# Altium schematic sheet CAN.SchDoc
size A4
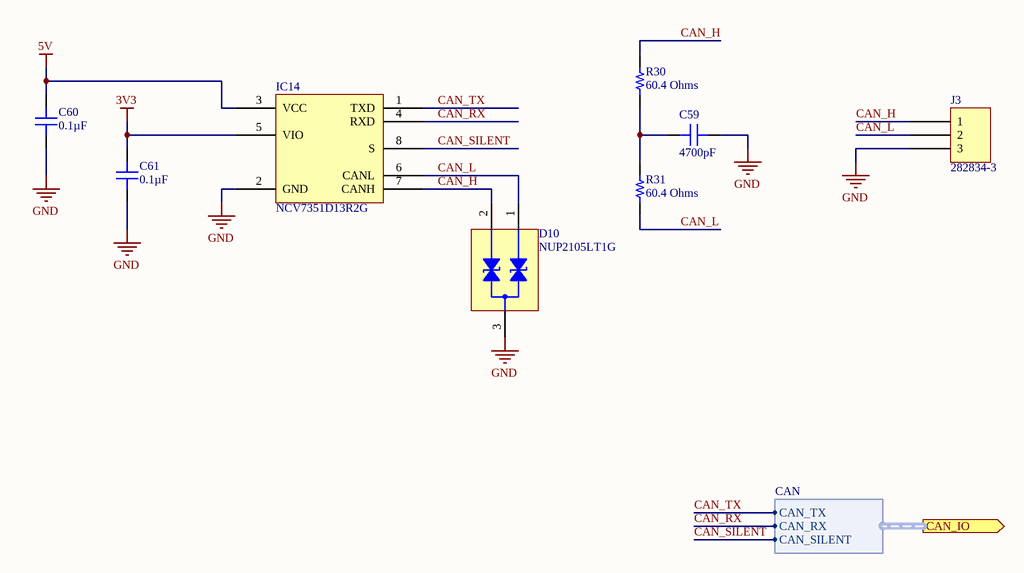
[diagram p0: CAN.SchDoc]

## Parts
C59  4700pF  [CAP 0201_0603]
C60  0.1µF  [CAP 0201_0603]
C61  0.1µF  [CAP 0201_0603]
D10  NUP2105LT1G  [ON SEMI SOT-23-3]
IC14  NCV7351D13R2G  [ON SEMI - SOIC-8 751AZ]
J3  282834-3  [TE 282834-3]
R30  60.4 Ohms  [RES 0201_0603]
R31  60.4 Ohms  [RES 0201_0603]

## Ports
CAN_IO (out, harness CAN)

## Harnesses
CAN: CAN_TX, CAN_RX, CAN_SILENT

## Nets
3V3: C61.2 IC14.5(VIO)
5V: C60.2 IC14.3(VCC)
GND: C59.2 C60.1 C61.1 D10.3(I/O_2) IC14.2(GND) J3.3
CAN_H: D10.2(GND) IC14.7(CANH) J3.1 R30.1
CAN_L: D10.1(I/O_1) IC14.6(CANL) J3.2 R31.2
CAN_RX: IC14.4(RXD) ; port CAN_IO.CAN_RX
CAN_SILENT: IC14.8(S) ; port CAN_IO.CAN_SILENT
CAN_TX: IC14.1(TXD) ; port CAN_IO.CAN_TX
NetC59_1: C59.1 R30.2 R31.1

## Notes on the sheet
- Title
- Size:
- Date:
- A4
- Number:
- Time:
- Revision:
- Sheet
- of
- File:

## Library data of the parts
C59 = GRM033R71E472KE14D: CAP CER 4700PF 25V X7R 0201; Manufacturer: Murata Electronics; Tolerance: ±10%; Part Number: GRM033R71E472KE14D; Value: 4700pF; Applications: General Purpose; Capacitance: 4700pF; ComponentLink1Description: Datasheet; ComponentLink1URL: https://search.murata.co.jp/Ceramy/image/img/A01X/G101/ENG/GRM033R71E472KE14-01.pdf; ComponentLink2Description: DigiKey Link; ComponentLink2URL: http://digikey.com/product-detail/en/murata-electronics/GRM033R71E472KE14D/490-14455-1-ND/6606916; Device Package: 0201 (0603 Metric); LastUpdated: 21/01/2020 00:00:16; Lifecycle Status: Active; Minimum Order: 1; Mounting Type: Surface Mount, MLCC; Operating Temperature: -55°C ~ 125°C; Package / Case: 0201 (0603 Metric); Packaging: CutTape; PartId: 986; Part Status: Active; Price: 0.10; Series: GRM; Size / Dimension: 0.024" L x 0.012" W (0.60mm x 0.30mm); Supplier 1: DigiKey; Supplier Part Number 1: 490-14455-1-ND; Temperature Coefficient: X7R; Thickness (Max): 0.013" (0.33mm); Voltage - Rated: 25V
C60 C61 = GRM033R61C104ME84D: CAP CER 0.1UF 16V X5R 0201; Manufacturer: Murata Electronics; Tolerance: ±20%; Part Number: GRM033R61C104ME84D; Value: 0.1µF; Applications: General Purpose; Capacitance: 0.1µF; ComponentLink1Description: Datasheet; ComponentLink1URL: https://search.murata.co.jp/Ceramy/image/img/A01X/G101/ENG/GRM033R61C104ME84-01.pdf; ComponentLink2Description: DigiKey Link; ComponentLink2URL: http://digikey.com/product-detail/en/murata-electronics/GRM033R61C104ME84D/490-9986-1-ND/5026291; Device Package: 0201 (0603 Metric); LastUpdated: 21/01/2020 00:00:12; Lifecycle Status: Active; Minimum Order: 1; Mounting Type: Surface Mount, MLCC; Operating Temperature: -55°C ~ 85°C; Package / Case: 0201 (0603 Metric); Packaging: TapeAndReel; PartId: 1522; Part Status: Active; Price: 0.01; Series: GRM; Size / Dimension: 0.024" L x 0.012" W (0.60mm x 0.30mm); Supplier 1: DigiKey; Supplier Part Number 1: 490-9986-1-ND; Temperature Coefficient: X5R; Thickness (Max): 0.013" (0.33mm); Voltage - Rated: 16V
D10 = NUP2105LT1G: TVS DIODE 24V 44V SOT23-3; Manufacturer: ON Semiconductor; Bidirectional Channels: 2; Capacitance @ Frequency: 30pF @ 1MHz; Current - Peak Pulse (10/1000µs): 8A (8/20µs); Power Line Protection: No; Power - Peak Pulse: 350W; Type: Zener; Voltage - Breakdown (Min): 26.2V; Voltage - Reverse Standoff (Typ): 24V (Min); Part Number: NUP2105LT1G; Applications: General Purpose; ComponentLink1Description: Datasheet; ComponentLink1URL: http://www.onsemi.com/pub/Collateral/NUP2105L-D.PDF; ComponentLink2Description: DigiKey Link; ComponentLink2URL: http://digikey.com/product-detail/en/on-semiconductor/NUP2105LT1G/NUP2105LT1GOSCT-ND/1485001; Device Package: TO-236-3, SC-59, SOT-23-3; LastUpdated: 30/03/2020 16:33:57; Lifecycle Status: Active; Minimum Order: 1; Mounting Type: Surface Mount; Operating Temperature: -55°C ~ 150°C (TJ); Package / Case: TO-236-3, SC-59, SOT-23-3; Packaging: TapeAndReel; PartId: 10506; Part Status: Active; Price: 0.09; Series: -; Supplier 1: DigiKey; Supplier Part Number 1: NUP2105LT1GOSCT-ND; Supplier Device Package: SOT-23-3 (TO-236); Voltage - Clamping (Max) @ Ipp: 44V
IC14 = NCV7351D13R2G: IC TRANSCEIVER HALF 1/1 8SOIC; Manufacturer: ON Semiconductor; Protocol: CANbus; Voltage - Supply: 4.5V ~ 5.5V; Part Number: NCV7351D13R2G; ComponentLink1Description: Datasheet; ComponentLink1URL: http://www.onsemi.com/pub/Collateral/NCV7351-D.PDF; ComponentLink2Description: DigiKey Link; ComponentLink2URL: http://digikey.com/product-detail/en/on-semiconductor/NCV7351D13R2G/NCV7351D13R2GOSCT-ND/4707705; Device Package: 8-SOIC (0.154", 3.90mm Width); Duplex: Half; LastUpdated: 30/03/2020 16:32:13; Lifecycle Status: Active; Minimum Order: 1; Mounting Type: Surface Mount; Number of Drivers/Receivers: 1/1; Operating Temperature: -40°C ~ 125°C; Package / Case: 8-SOIC (0.154", 3.90mm Width); Packaging: TapeAndReel; Part Status: Active; Price: 0.36; Series: Automotive, AEC-Q100; Supplier 1: DigiKey; Supplier Part Number 1: NCV7351D13R2GOSCT-ND; Supplier Device Package: 8-SOIC; Type: Transceiver
J3 = 282834-3: TERM BLK 3P SIDE ENT 2.54MM PCB; Manufacturer: TE Connectivity AMP Connectors; Current: 10A; Mating Orientation: Horizontal with Board; Number of Levels: 1; Pitch: 0.100" (2.54mm); Positions Per Level: 3; Voltage: 150V; Wire Gauge: 16-30 AWG; Wire Termination: Screw - Rising Cage Clamp; Part Number: 282834-3; Color: Green; ComponentLink1Description: Datasheet; ComponentLink1URL: https://www.te.com/commerce/DocumentDelivery/DDEController?Action=srchrtrv&DocNm=282834&DocType=Customer+Drawing&DocLang=English; ComponentLink2Description: DigiKey Link; ComponentLink2URL: http://digikey.com/product-detail/en/te-connectivity-amp-connectors/282834-3/A98334-ND/1153264; LastUpdated: 15/01/2020 04:15:50; Lifecycle Status: Active; Minimum Order: 1; Mounting Type: Through Hole; Packaging: Bulk; Part Status: Active; Price: 2.01; Series: Buchanan; Supplier 1: DigiKey; Supplier Part Number 1: A98334-ND
R30 R31 = ERJ-1GNF60R4C: RES SMD 60.4 OHM 1% 1/20W 0201; Manufacturer: Panasonic Electronic Components; Power (Watts): 0.05W, 1/20W; Temperature Coefficient: ±200ppm/°C; Part Number: ERJ-1GNF60R4C; Value: 60.4 Ohms; ComponentLink1Description: Datasheet; ComponentLink1URL: https://industrial.panasonic.com/cdbs/www-data/pdf/RDA0000/AOA0000C304.pdf; ComponentLink2Description: DigiKey Link; ComponentLink2URL: http://digikey.com/product-detail/en/panasonic-electronic-components/ERJ-1GNF60R4C/P123098CT-ND/8343135; Composition: Thick Film; Device Package: 0201 (0603 Metric); Features: Automotive AEC-Q200; Height - Seated (Max): 0.010" (0.26mm); LastUpdated: 21/01/2020 00:04:11; Lifecycle Status: Active; Minimum Order: 1; Number of Terminations: 2; Operating Temperature: -55°C ~ 125°C; Package / Case: 0201 (0603 Metric); Packaging: TapeAndReel; PartId: 3528; Part Status: Active; Price: 0.01; Ratings: AEC-Q200; Resistance: 60.4 Ohms; Series: ERJ; Size / Dimension: 0.024" L x 0.012" W (0.60mm x 0.30mm); Supplier 1: DigiKey; Supplier Part Number 1: P123098CT-ND; Supplier Device Package: 0201; Tolerance: ±1%